# Altium schematic sheet Precharge.SchDoc
size A3
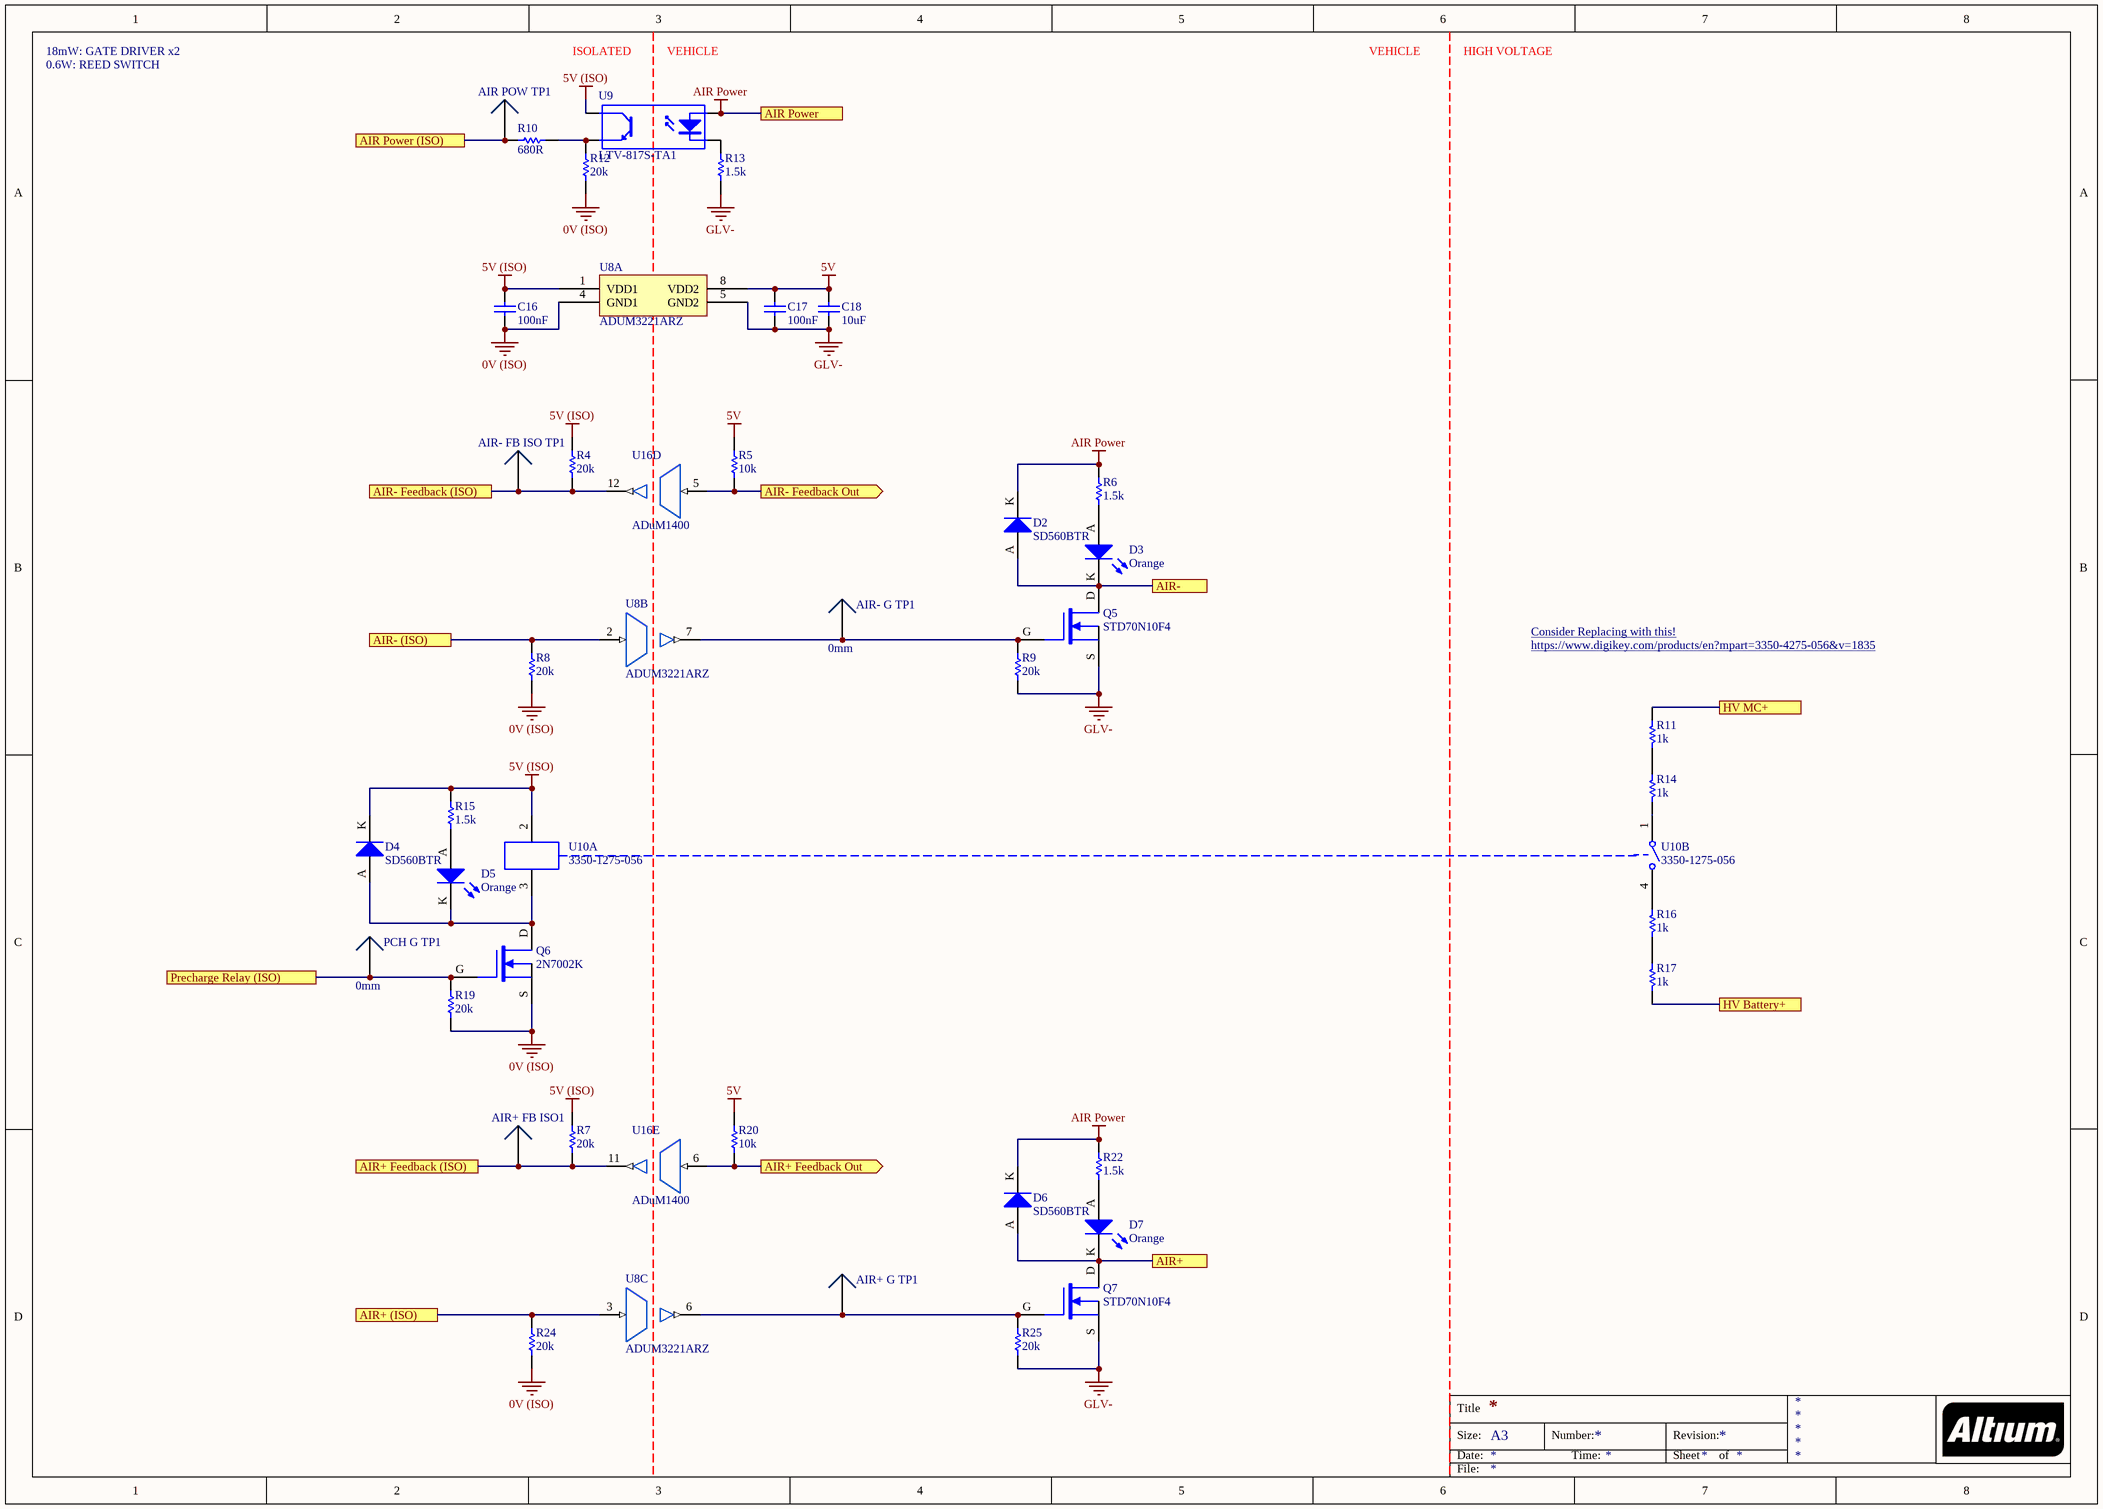
[diagram p0: Precharge.SchDoc]

## Parts
AIR+_FB_ISO1  0mm  [SMD Test Point]  (value not drawn)
AIR+_G_TP1  0mm  [SMD Test Point]  (value not drawn)
AIR-_FB_ISO_TP1  0mm  [SMD Test Point]  (value not drawn)
AIR-_G_TP1  0mm  [SMD Test Point]
AIR_POW_TP1  0mm  [SMD Test Point]  (value not drawn)
C16  100nF  [0805]
C17  100nF  [0805]
C18  10uF  [0805]
D2  SD560BTR  [SMB Diode]
D3  Orange  [0805 LED]
D4  SD560BTR  [SMB Diode]
D5  Orange  [0805 LED]
D6  SD560BTR  [SMB Diode]
D7  Orange  [0805 LED]
PCH_G_TP1  0mm  [SMD Test Point]
Q5  STD70N10F4  [SOT-343_N]
Q6  2N7002K  [SOT-343_N]
Q7  STD70N10F4  [SOT-343_N]
R4  20k  [0805]
R5  10k  [0805]
R6  1.5k  [0805]
R7  20k  [0805]
R8  20k  [0805]
R9  20k  [0805]
R10  680R  [0805]
R11  1k  [B TO-263]
R12  20k  [0805]
R13  1.5k  [0805]
R14  1k  [B TO-263]
R15  1.5k  [0805]
R16  1k  [B TO-263]
R17  1k  [B TO-263]
R19  20k  [0805]
R20  10k  [0805]
R22  1.5k  [0805]
R24  20k  [0805]
R25  20k  [0805]
U8  ADUM3221ARZ  [AD 8-SOIC]  (parts A,B,C of 3)
U9  LTV-817S-TA1  [ON 4-SMD]
U10  3350-1275-056  [CI SPST]  (parts A,B of 2)
U16  ADuM1400  [AD 16-SOIC]  (parts D,E of 5)

## Ports
AIR Power, AIR Power (ISO), AIR+, AIR+ (ISO), AIR+ Feedback (ISO), AIR+ Feedback Out (out), AIR-, AIR- (ISO), AIR- Feedback (ISO), AIR- Feedback Out (out), HV Battery+, HV MC+, Precharge Relay (ISO)

## Nets
0V (ISO): C16.1 Q6.S R8.1 R12.1 R19.1 R24.1 U8.4(GND1)
5V: C17.2 C18.2 R5.2 R20.2 U8.8(VDD2)
5V (ISO): C16.2 D4.K R4.2 R7.2 R15.2 U8.1(VDD1) U9.4(C) U10.2
AIR Power: D2.K D6.K R6.2 R22.2 U9.1(A) ; port AIR Power
GLV-: C17.1 C18.1 Q5.S Q7.S R9.1 R13.2 R25.1 U8.5(GND2)
AIR Power (ISO): AIR_POW_TP1.1 R10.1 ; port AIR Power (ISO)
AIR+: D6.A D7.K Q7.D ; port AIR+
AIR+ (ISO): R24.2 U8.3(VIA) ; port AIR+ (ISO)
AIR+ Feedback (ISO): AIR+_FB_ISO1.1 R7.1 U16.11(VOD) ; port AIR+ Feedback (ISO)
AIR+ Feedback Out: R20.1 U16.6(VID) ; port AIR+ Feedback Out
AIR-: D2.A D3.K Q5.D ; port AIR-
AIR- (ISO): R8.2 U8.2(VIA) ; port AIR- (ISO)
AIR- Feedback (ISO): AIR-_FB_ISO_TP1.1 R4.1 U16.12(VOC) ; port AIR- Feedback (ISO)
AIR- Feedback Out: R5.1 U16.5(VIC) ; port AIR- Feedback Out
HV Battery+: R17.1 ; port HV Battery+
HV MC+: R11.2 ; port HV MC+
Precharge Relay (ISO): PCH_G_TP1.1 Q6.G R19.2 ; port Precharge Relay (ISO)
NetAIR+_G_TP1_1: AIR+_G_TP1.1 Q7.G R25.2 U8.6(VOA)
NetAIR-_G_TP1_1: AIR-_G_TP1.1 Q5.G R9.2 U8.7(VOA)
NetD3_A: D3.A R6.1
NetD4_A: D4.A D5.K Q6.D U10.3
NetD5_A: D5.A R15.1
NetD7_A: D7.A R22.1
NetR10_2: R10.2 R12.2 U9.3(E)
NetR11_1: R11.1 R14.2
NetR13_1: R13.1 U9.2(K)
NetR14_1: R14.1 U10.1
NetR16_1: R16.1 R17.2
NetR16_2: R16.2 U10.4

## Notes on the sheet
- 18mW: GATE DRIVER x2
- 0.6W: REED SWITCH
- ISOLATED
- VEHICLE
- HIGH VOLTAGE
- https://www.digikey.com/products/en?mpart=3350-4275-056&v=1835
- Consider Replacing with this! <https://www.digikey.com/products/en?mpart=3350-4275-056&v=1835>
- Title
- Size:
- Date:
- A3
- Number:
- Time:
- Revision:
- Sheet
- of
- File:

## Library data of the parts
AIR+_FB_ISO1 AIR+_G_TP1 AIR-_FB_ISO_TP1 AIR-_G_TP1 AIR_POW_TP1 PCH_G_TP1 = SMD Test Point: Positions: 1; Row Spacing: 0; Flange: No; Contact: NA; Part Number: SMD Test Point; Pitch: 0mm; Angle: 0
C16 C17 = GCM21BR71E104KA37L: Manufacturer: muRata; Tolerance: 10%; Material: X7R; Rated Voltage: 25V; Part Number: GCM21BR71E104KA37L; Value: 100nF
C18 = GRM21BR6YA106KE43L: Manufacturer: muRata; Tolerance: 10%; Material: X5R; Rated Voltage: 50V; Part Number: GRM21BR6YA106KE43L; Value: 10uF; Digikey Part Number: 490-10514-6-ND
D2 D4 D6 = SD560BTR: 1.2V_F 600V 5A SMB; Manufacturer: SMC Diode Solutions; Part Number: SD560BTR; Digikey Part Number: 1655-1530-2-ND; Digikey Link: https://www.digikey.com/product-detail/en/smc-diode-solutions/SD560BTR/1655-1530-2-ND/6022620
D3 D5 D7 = SML-211DTT86: Orange LED Indication - Discrete 1.75V 0805 (2012 Metric); Manufacturer: ROHM Semiconductor; Part Number: SML-211DTT86; Colour: Orange; Digikey Part Number: 511-1291-1-ND; Digikey Link: https://www.digikey.com/product-detail/en/rohm-semiconductor/SML-211DTT86/511-1291-1-ND/637104
Q5 Q7 = STD70N10F4: N-Channel 100V 60A (Tc) 125W (Tc) Surface Mount DPAK; Manufacturer: STMicroelectronics; Published: 24-Mar-1999; LatestRevisionDate: 29-May-2009; LatestRevisionNote: IPC-7351 Footprint Added.; PackageVersion: Sep-2000; PackageReference: SOT-343; Publisher: Altium Limited; PackageDescription: 4-Pin SOT-343 Package 1.3 mm Pitch, 2.1 mm Lead Span; Part Number: STD70N10F4; Digikey Part Number: 497-8806-2-ND; Digikey Link: https://www.digikey.com/product-detail/en/stmicroelectronics/STD70N10F4/497-8806-2-ND/2035599
Q6 = 2N7002K: 60V 380mA, NFET MOSTFET (Small Signal); Manufacturer: ON Semiconductor; Published: 24-Mar-1999; LatestRevisionDate: 29-May-2009; LatestRevisionNote: IPC-7351 Footprint Added.; PackageVersion: Sep-2000; PackageReference: SOT-343; Publisher: Altium Limited; PackageDescription: 4-Pin SOT-343 Package 1.3 mm Pitch, 2.1 mm Lead Span; Part Number: 2N7002K; Digikey Part Number: 2N7002KCT-ND; Digikey Link: https://www.digikey.com/product-detail/en/on-semiconductor/2N7002K/2N7002KCT-ND/2060375; Qty: 30
R4 R7-R9 R12 R19 R24 R25 = RC0805FR0720KL: Manufacturer: YAGEO; Tolerance: 0.01; Rated Voltage: 0.125W; Part Number: RC0805FR0720KL; Value: 20k; Material: FR-07
R5 R20 = RC0805FR0710KL: Manufacturer: YAGEO; Tolerance: 0.01; Rated Voltage: 0.125W; Part Number: RC0805FR0710KL; Value: 10k; Material: FR-07
R6 R13 R15 R22 = RC0805FR071K5L: Manufacturer: YAGEO; Tolerance: 0.01; Rated Voltage: 0.125W; Part Number: RC0805FR071K5L; Value: 1.5k; Material: FR-07
R10 = RC0805FR07680RL: Manufacturer: YAGEO; Tolerance: 0.01; Rated Voltage: 0.125W; Part Number: RC0805FR07680RL; Value: 680R; Material: FR-07
R11 R14 R16 R17 = PWR263S-35-1001J: Manufacturer: Bournes Inc; Tolerance: 0.05; Rated Voltage: 35W; Part Number: PWR263S-35-1001J; Value: 1k; Digikey Part Number: PWR263S-35-1001J-ND
U8 = ADUM3221ARZ: 4A Gate Driver Magnetic Coupling 2500Vrms 2 Channel 8-SOIC; Manufacturer: Analog Devices; Part Number: ADUM3221ARZ; Digikey Part Number: ADUM3221ARZ-ND; Digikey Link: https://www.digikey.com/product-detail/en/analog-devices-inc/ADUM3221ARZ/ADUM3221ARZ-ND/2616333
U9 = LTV-817S-TA1: 35V 50ma Optocoupler (VF=1.2V); Manufacturer: Lite-On Inc; Part Number: LTV-817S-TA1; Digikey Part Number: 160-1893-2-ND; Digikey Link: https://www.digikey.com/product-detail/en/lite-on-inc/LTV-817S-TA1/160-1893-2-ND/388451
U10 = 3350-1275-056: RELAY REED HV SPST 200W 3A 5V (NO); Manufacturer: Comus International; Part Number: 3350-1275-056; Digikey Part Number: 1835-1036-ND; Digikey Link: https://www.digikey.com.au/product-detail/en/comus-international/3350-1275-056/1835-1036-ND/7515918
U16 = ADuM1400: General Purpose Digital Isolator 2500Vrms 4 Channel 1Mbps 25kV/µs CMTI 16-SOIC (0.295", 7.50mm Width); Manufacturer: Analog Devices; Part Number: ADuM1400; Digikey Part Number: ADUM1400WSRWZ-ND; Digikey Link: https://www.digikey.com/product-detail/en/analog-devices-inc/ADUM1400WSRWZ/ADUM1400WSRWZ-ND/1873713